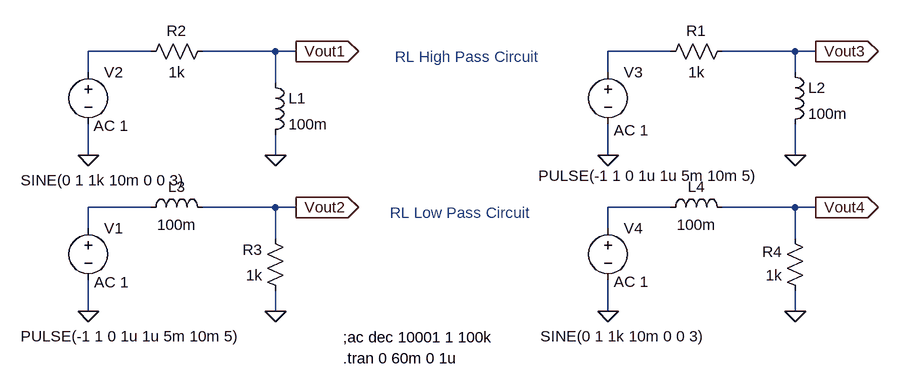
[diagram p0: schematic RL.asc]
RL.asc, the LTspice schematic file:
Version 4
SHEET 1 1220 680
WIRE 80 -160 -16 -160
WIRE 272 -160 160 -160
WIRE 304 -160 272 -160
WIRE 880 -160 784 -160
WIRE 1072 -160 960 -160
WIRE 1104 -160 1072 -160
WIRE -16 -128 -16 -160
WIRE 784 -128 784 -160
WIRE 1072 -128 1072 -160
WIRE 272 -112 272 -160
WIRE -16 0 -16 -48
WIRE 272 0 272 -32
WIRE 784 0 784 -48
WIRE 1072 0 1072 -48
WIRE 80 80 -16 80
WIRE 272 80 160 80
WIRE 304 80 272 80
WIRE 880 80 784 80
WIRE 1072 80 960 80
WIRE 1104 80 1072 80
WIRE -16 112 -16 80
WIRE 784 112 784 80
WIRE 272 128 272 80
WIRE 1072 128 1072 80
WIRE -16 240 -16 192
WIRE 272 240 272 208
WIRE 784 240 784 192
WIRE 1072 240 1072 208
FLAG -16 240 0
FLAG 272 240 0
FLAG -16 0 0
FLAG 272 0 0
FLAG 304 -160 Vout1
IOPIN 304 -160 Out
FLAG 304 80 Vout2
IOPIN 304 80 Out
FLAG 784 0 0
FLAG 1072 0 0
FLAG 1104 -160 Vout3
IOPIN 1104 -160 Out
FLAG 784 240 0
FLAG 1072 240 0
FLAG 1104 80 Vout4
IOPIN 1104 80 Out
SYMBOL voltage -16 96 R0
WINDOW 3 -104 182 Left 2
WINDOW 123 9 99 Left 2
WINDOW 39 0 0 Left 2
SYMATTR Value PULSE(-1 1 0 1u 1u 5m 10m 5)
SYMATTR Value2 AC 1
SYMATTR InstName V1
SYMBOL res 176 -176 R90
WINDOW 0 0 56 VBottom 2
WINDOW 3 32 56 VTop 2
SYMATTR InstName R2
SYMATTR Value 1k
SYMBOL voltage -16 -144 R0
WINDOW 3 -104 182 Left 2
WINDOW 123 8 98 Left 2
WINDOW 39 0 0 Left 2
SYMATTR Value SINE(0 1 1k 10m 0 0 3)
SYMATTR Value2 AC 1
SYMATTR InstName V2
SYMBOL res 288 224 R180
WINDOW 0 36 79 Left 2
WINDOW 3 36 40 Left 2
SYMATTR InstName R3
SYMATTR Value 1k
SYMBOL res 976 -176 R90
WINDOW 0 0 56 VBottom 2
WINDOW 3 32 56 VTop 2
SYMATTR InstName R1
SYMATTR Value 1k
SYMBOL voltage 784 -144 R0
WINDOW 3 -107 175 Left 2
WINDOW 123 9 105 Left 2
WINDOW 39 0 0 Left 2
SYMATTR Value PULSE(-1 1 0 1u 1u 5m 10m 5)
SYMATTR Value2 AC 1
SYMATTR InstName V3
SYMBOL voltage 784 96 R0
WINDOW 3 -104 182 Left 2
WINDOW 123 9 98 Left 2
WINDOW 39 0 0 Left 2
SYMATTR Value SINE(0 1 1k 10m 0 0 3)
SYMATTR Value2 AC 1
SYMATTR InstName V4
SYMBOL res 1088 224 R180
WINDOW 0 36 76 Left 2
WINDOW 3 36 40 Left 2
SYMATTR InstName R4
SYMATTR Value 1k
SYMBOL ind 256 -128 R0
SYMATTR InstName L1
SYMATTR Value 100m
SYMBOL ind 1056 -144 R0
SYMATTR InstName L2
SYMATTR Value 100m
SYMBOL ind 64 96 R270
WINDOW 0 32 56 VTop 2
WINDOW 3 5 56 VBottom 2
SYMATTR InstName L3
SYMATTR Value 100m
SYMBOL ind 864 96 R270
WINDOW 0 32 56 VTop 2
WINDOW 3 5 56 VBottom 2
SYMATTR InstName L4
SYMATTR Value 100m
TEXT 376 312 Left 2 !.tran 0 60m 0 1u
TEXT 376 280 Left 2 !;ac dec 10001 1 100k
TEXT 456 -152 Left 2 ;RL High Pass Circuit
TEXT 448 88 Left 2 ;RL Low Pass Circuit

The netlist it stands for:
* RL.asc
V1 N003 0 PULSE(-1 1 0 1u 1u 5m 10m 5) AC 1
R2 Vout1 N001 1k
V2 N001 0 SINE(0 1 1k 10m 0 0 3) AC 1
R3 0 Vout2 1k
R1 Vout3 N002 1k
V3 N002 0 PULSE(-1 1 0 1u 1u 5m 10m 5) AC 1
V4 N004 0 SINE(0 1 1k 10m 0 0 3) AC 1
R4 0 Vout4 1k
L1 Vout1 0 100m
L2 Vout3 0 100m
L3 N003 Vout2 100m
L4 N004 Vout4 100m
.tran 0 60m 0 1u
;ac dec 10001 1 100k
* RL High Pass Circuit
* RL Low Pass Circuit
.backanno
.end